# Altium schematic sheet PowerSwitch.SchDoc
size A4; DocumentNumber: 40; SheetNumber: 40; SheetTotal: 47
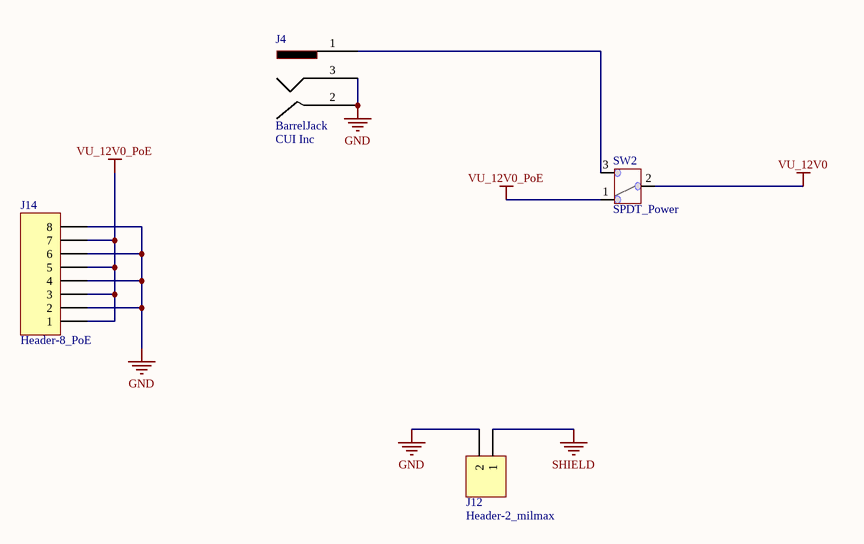
[diagram p0: PowerSwitch.SchDoc]

## Parts
J4  BarrelJack  Manufacturer: CUI Inc  [BarrelJack_PJ-028-SMT]
J12  Header-2_milmax  [Header_Mil-Max_800-10-002-40-002000_2-Pos]
J14  Header-8_PoE  [Header_FCI_20021221-00008T4LF_8-pos]
SW2  SPDT_Power  [SPDT_Power_L102021ML04Q_Thru-Hole]

## Nets
GND: J4.2 J4.3 J12.2 J14.2 J14.4 J14.6 J14.8
SHIELD: J12.1
VU_12V0: SW2.2
VU_12V0_PoE: J14.1 J14.3 J14.5 J14.7 SW2.1
NetJ4_1: J4.1 SW2.3

## Library data of the parts
J4 = PJ-028-SMT: CONN PWR JACK 0.8X3.35MM SMT; Part Number: PJ-028-SMT; Footprint Ref: BarrelJack_PJ-028-SMT; Library Ref: BarrelJack
J12 = 800-10-002-40-002000: CONN HEADER 2POS .100" HORIZ SMD; Manufacturer: Mill-Max Manufacturing Corp.; Part Number: 800-10-002-40-002000
J14 = 20021221-00008T4LF: CONN HEADER 8POS DUAL SHRD SMD; Manufacturer: FCI; Part Number: 20021221-00008T4LF
SW2 = L102021ML04Q: SWITCH SLIDE MINI SPDT R/A; Manufacturer: C&K Components; Value: 4A; Part Number: L102021ML04Q